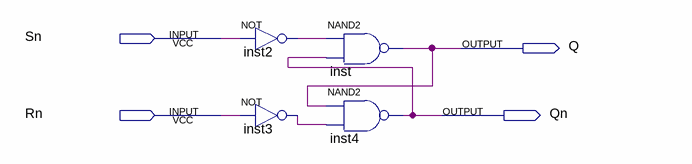
[diagram p0: schematic sheet]
// Quartus schematic SRnorLatch5.bdf as structural Verilog: 4 symbols, 4 pins
module SRnorLatch5 (
  input  Sn,
  input  Rn,
  output Q,
  output Qn
);

  wire inst2_out, inst3_out;

  not inst2 (inst2_out, Sn);
  not inst3 (inst3_out, Rn);
  nand inst (Q, inst2_out, Qn);
  nand inst4 (Qn, Q, inst3_out);
endmodule
